# EAGLE design BLE Development Board v2.2 (EAGLE 6.4)
Bluetooth Low Energy Development Board Full breakout board for HM-10 module based on CC2540 chip with optional LEDs, programming header, USB access, etc.
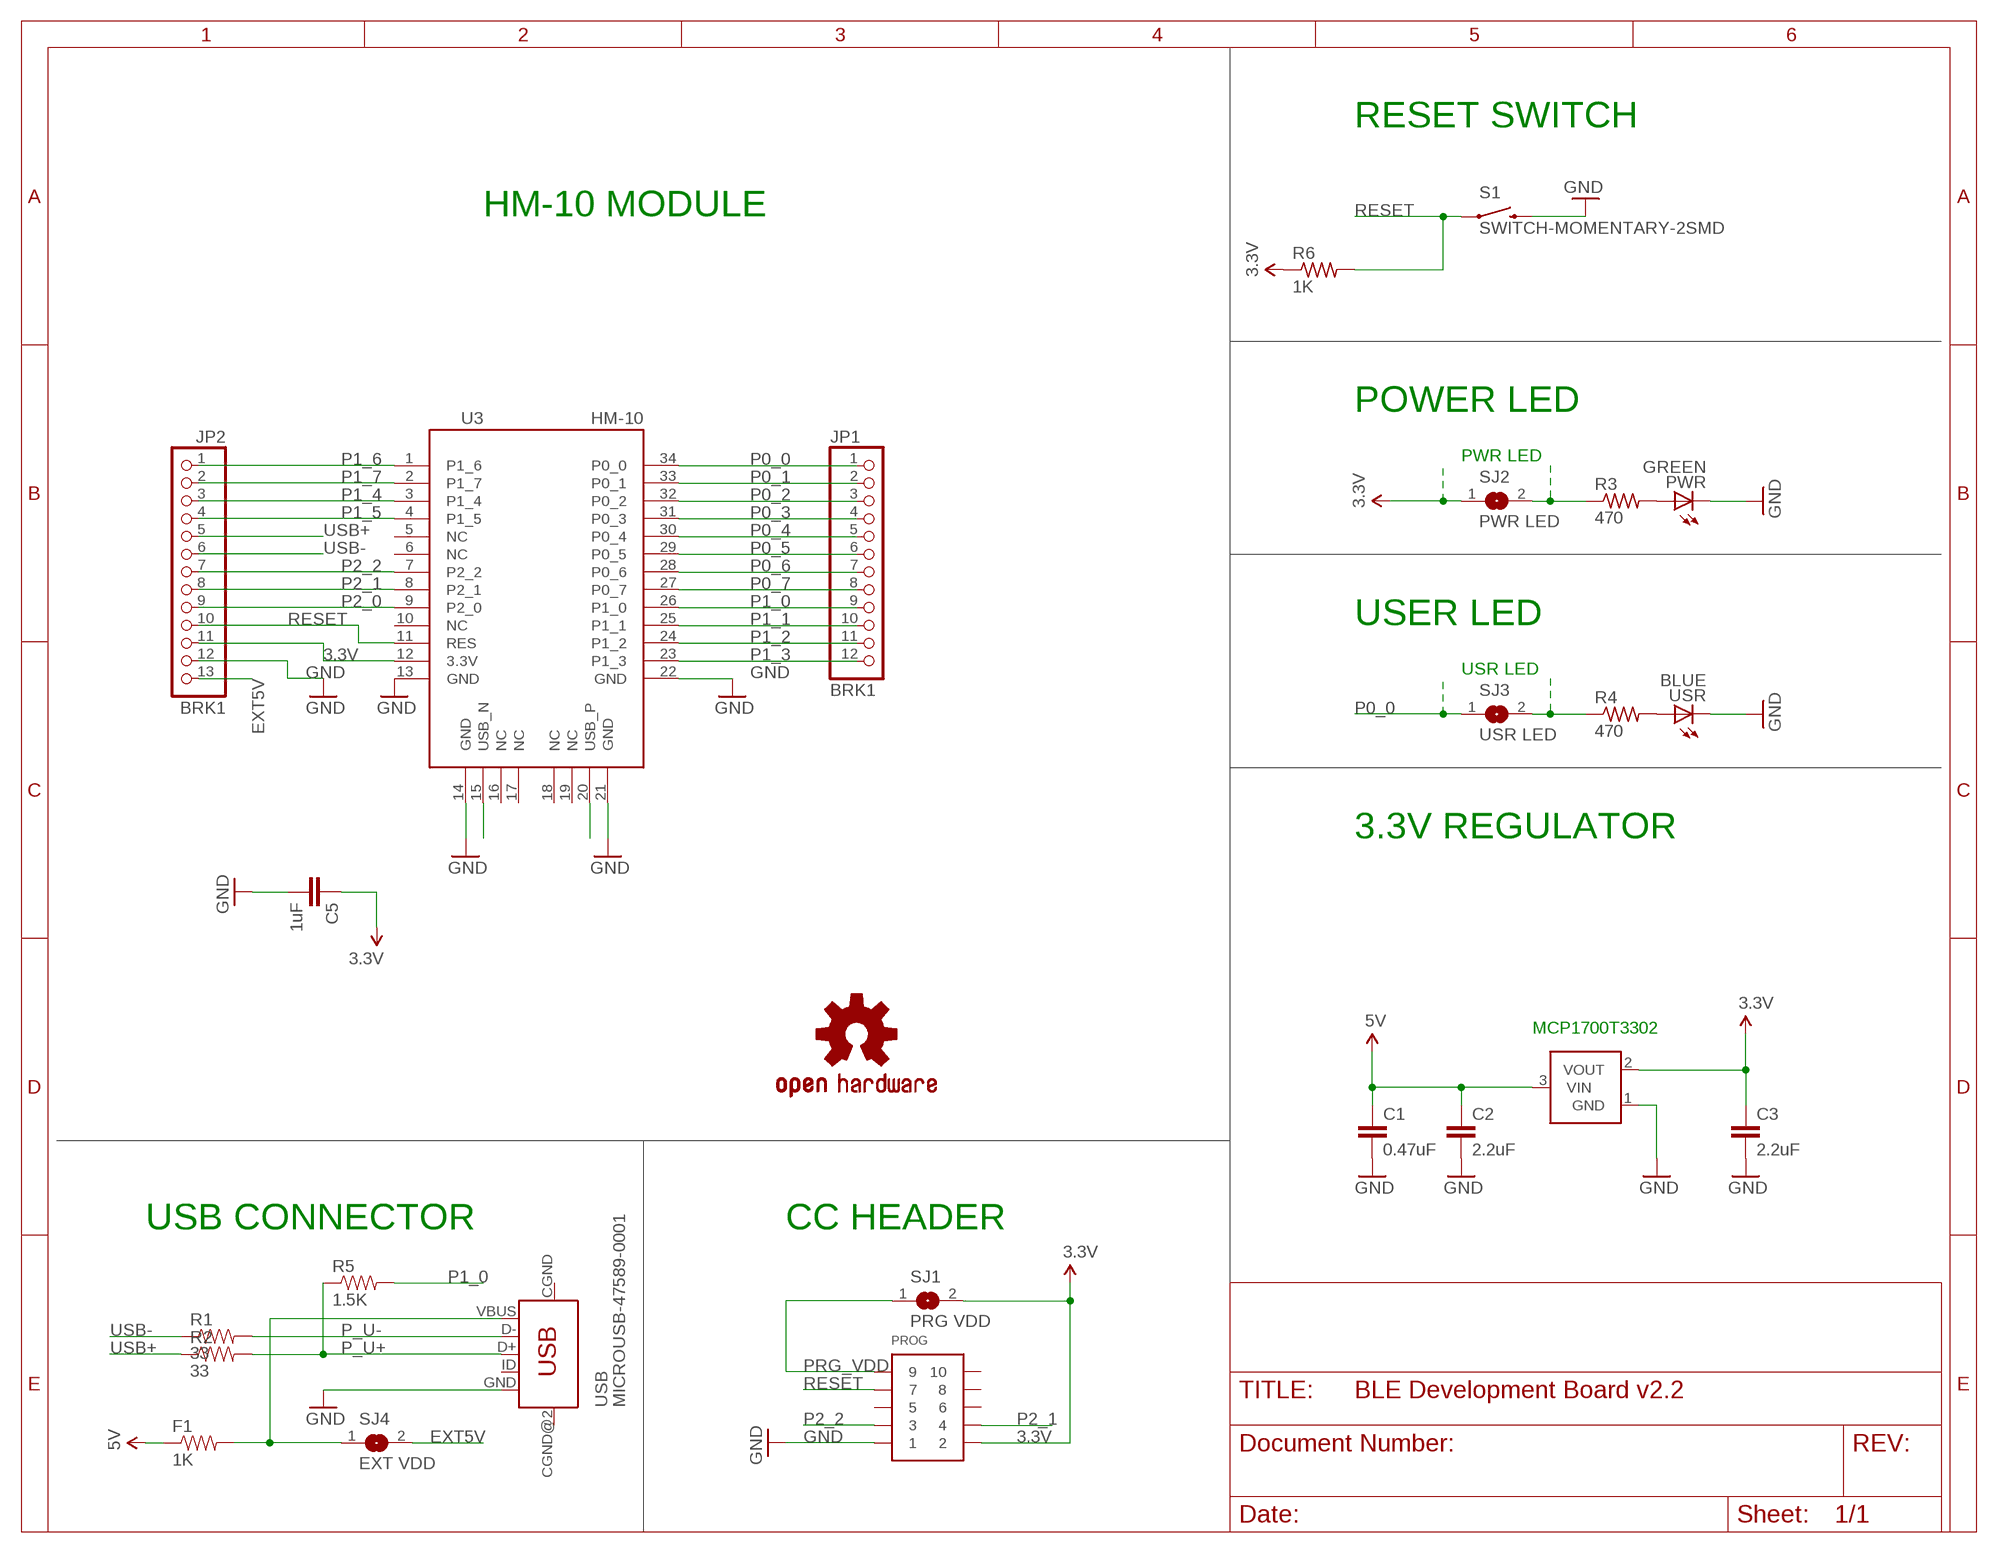
[diagram p0: schematic, sheet 1]

## Parts
C1  0.47uF  CAP0603-CAP  [0603-CAP]
C2  2.2uF  CAP0603-CAP  [0603-CAP]
C3  2.2uF  CAP0603-CAP  [0603-CAP]
C5  1uF  CAP0603-CAP  [0603-CAP]
F1  1K  RESISTOR0805-RES  [0805]
JP1  BRK1  PINHD-1X12  [1X12]
JP2  BRK1  PINHD-1X13  [1X13]
OSHW1  OSHW-LOGOL  [OSHW-LOGO-L]
PROG  CONN_5-2-FTSH-V  [FTSH-105-DV]
PWR  GREEN  LEDCHIPLED_0603  [CHIPLED_0603]
R1  33  RESISTOR0603-RES  [0603-RES]
R2  33  RESISTOR0603-RES  [0603-RES]
R3  470  R-US_R0603  [R0603]
R4  470  R-US_R0603  [R0603]
R5  1.5K  RESISTOR0603-RES  [0603-RES]
R6  1K  R-US_R0603  [R0603]
S1  SWITCH-MOMENTARY-2SMD  [TACTILE_SWITCH_SMD]
SJ1  PRG VDD  SJ  [SJ]
SJ2  PWR LED  SJ  [SJ]
SJ3  USR LED  SJ  [SJ]
SJ4  EXT VDD  SJ  [SJ]
U2  MCP1700  [SOT23-3]
U3  HM-10  [HM-10]
USB  MICROUSB-47589-0001  [MICROUSB-47589-0001]
USR  BLUE  LEDCHIPLED_0603  [CHIPLED_0603]

## Nets
3.3V [power]: C3.1 C5.1 JP2.11 PROG.2 R6.1 SJ1.2 SJ2.1 U2.2(VOUT) U3.12(3.3V)
5V [power]: C1.1 C2.1 F1.1 U2.3(VIN)
EXT5V [power]: JP2.13 SJ4.2
GND [power]: C1.2 C2.2 C3.2 C5.2 JP2.12 PROG.1 PWR.C S1.3 U2.1(GND) U3.13(GND) U3.14(GND) U3.21(GND) U3.22(GND) USB.GND USR.C
N$1: PWR.A R3.2
N$3 [power]: R3.1 SJ2.2
N$4: R4.2 USR.A
N$5: R4.1 SJ3.2
P0_0: JP1.1 SJ3.1 U3.34(P0_0)
P0_1: JP1.2 U3.33(P0_1)
P0_2: JP1.3 U3.32(P0_2)
P0_3: JP1.4 U3.31(P0_3)
P0_4: JP1.5 U3.30(P0_4)
P0_5: JP1.6 U3.29(P0_5)
P0_6: JP1.7 U3.28(P0_6)
P0_7: JP1.8 U3.27(P0_7)
P1_0: JP1.9 R5.2 U3.26(P1_0)
P1_1: JP1.10 U3.25(P1_1)
P1_2: JP1.11 U3.24(P1_2)
P1_3: JP1.12 U3.23(P1_3)
P1_4: JP2.3 U3.3(P1_4)
P1_5: JP2.4 U3.4(P1_5)
P1_6: JP2.1 U3.1(P1_6)
P1_7: JP2.2 U3.2(P1_7)
P2_0: JP2.9 U3.9(P2_0)
P2_1: JP2.8 PROG.4 U3.8(P2_1)
P2_2: JP2.7 PROG.3 U3.7(P2_2)
P_U+: R2.2 R5.1 USB.D+
P_U-: R1.2 USB.D-
PRG_VDD [power]: PROG.9 SJ1.1
RESET: JP2.10 PROG.7 R6.2 S1.1 U3.11(RES)
USB+: JP2.5 R2.1 U3.20(USB_P)
USB-: JP2.6 R1.1 U3.15(USB_N)
VBUS [power]: F1.2 SJ4.1 USB.VBUS
Unconnected: PROG.5 PROG.6 PROG.8 PROG.10 U3.5(NC) U3.6(NC) U3.10(NC) U3.16(NC) U3.17(NC) U3.18(NC) U3.19(NC) USB.CGND(MTN2) USB.CGND@2(MTN4) USB.ID

## Notes on the sheet
- RESET SWITCH
- HM-10 MODULE
- POWER LED
- PWR LED
- USER LED
- USR LED
- 3.3V REGULATOR
- MCP1700T3302
- USB CONNECTOR | CC HEADER

## Library data of the parts
C1-C3 C5 = SparkFun:CAP: Capacitor Standard 0603 ceramic capacitor, and 0.1" leaded capacitor.
F1 R1 R2 R5 = SparkFun:RESISTOR: Resistor Basic schematic elements and footprints for 0603, 1206, and PTH resistors.
JP1 = sf-pinhead:PINHD-1X12: PIN HEADER
JP2 = sf-pinhead:PINHD-1X13: PIN HEADER
OSHW1 = SparkFun:OSHW-LOGO: Open Source Hardware Logo This logo indicates the piece of hardware it is found on incorporates a OSHW license and/or adheres to the definition of open source hardware found here: http://freedomdefined.org/OSHW
PROG = pel_misc:CONN_5-2
PWR USR = led:LED: LED OSRAM: - CHIPLED LG R971, LG N971, LY N971, LG Q971, LY Q971, LO R971, LY R971 LH N974, LH R974 LS Q976, LO Q976, LY Q976 LO Q996 - Hyper CHIPLED LW Q18S LB Q993, LB Q99A, LB R99A - SideLED LS A670, LO A670, LY A670, LG A670, LP A670 LB A673, LV A673, LT A673, LW A673 LH A674 LY A675 LS A676, LA A676, LO A676, LY A676, LW A676 LS A679, LY A679, LG A679 - Hyper Micro SIDELED® LS Y876, LA Y876, LO Y876, LY Y876 LT Y87S - SmartLED LW L88C, LW L88S LB L89C, LB L89S, LG L890 LS L89K, LO L89K, LY L89K LS L896, LA L896, LO L896, LY L896 - TOPLED LS T670, LO T670, LY T670, LG T670, LP T670 LSG T670, LSP T670, LSY T670, LOP T670, LYG T670 LG T671, LOG T671, LSG T671 LB T673, LV T673, LT T673, LW T673 LH T674 LS T676, LA T676, LO T676, LY T676, LB T676, LH T676, LSB T676, LW T676 LB T67C, LV T67C, LT T67C, LS T67K, LO T67K, LY T67K, LW E67C LS E67B, LA E67B, LO E67B, LY E67B, LB E67C, LV E67C, LT E67C LW T67C LS T679, LY T679, LG T679 LS T770, LO T770, LY T770, LG T770, LP T770 LB T773, LV T773, LT T773, LW T773 LH T774 LS E675, LA E675, LY E675, LS T675 LS T776, LA T776, LO T776, LY T776, LB T776 LHGB T686 LT T68C, LB T68C - Hyper Mini TOPLED® LB M676 - Mini TOPLED Santana® LG M470 LS M47K, LO M47K, LY M47K Source: http://www.osram.convergy.de LUXEON: - LUMILED® LXK2-PW12-R00, LXK2-PW12-S00, LXK2-PW14-U00, LXK2-PW14-V00 LXK2-PM12-R00, LXK2-PM12-S00, LXK2-PM14-U00 LXK2-PE12-Q00, LXK2-PE12-R00, LXK2-PE12-S00, LXK2-PE14-T00, LXK2-PE14-U00 LXK2-PB12-K00, LXK2-PB12-L00, LXK2-PB12-M00, LXK2-PB14-N00, LXK2-PB14-P00, LXK2-PB14-Q00 LXK2-PR12-L00, LXK2-PR12-M00, LXK2-PR14-Q00, LXK2-PR14-R00 LXK2-PD12-Q00, LXK2-PD12-R00, LXK2-PD12-S00 LXK2-PH12-R00, LXK2-PH12-S00 LXK2-PL12-P00, LXK2-PL12-Q00, LXK2-PL12-R00 Source: www.luxeon.com KINGBRIGHT: KA-3528ASYC Source: www.kingbright.com
R3 R4 R6 = resistor:R-US_: RESISTOR, American symbol
S1 = SparkFun-Electromechanical:SWITCH-MOMENTARY-2: Various NO switches- pushbuttons, reed, etc
SJ1-SJ4 = jumper:SJ: SMD solder JUMPER
U2 = nonolith:MCP1700: Voltage regulator
U3 = HM-10_BLE:HM-10
USB = sf-keyglove:MICROUSB-47589-0001

## Net classes
0 default: width 0.152 mm, drill 0.33 mm, clearance 0.152 mm
1 power: width 0.254 mm, drill 0.33 mm, clearance 0.152 mm

## Board
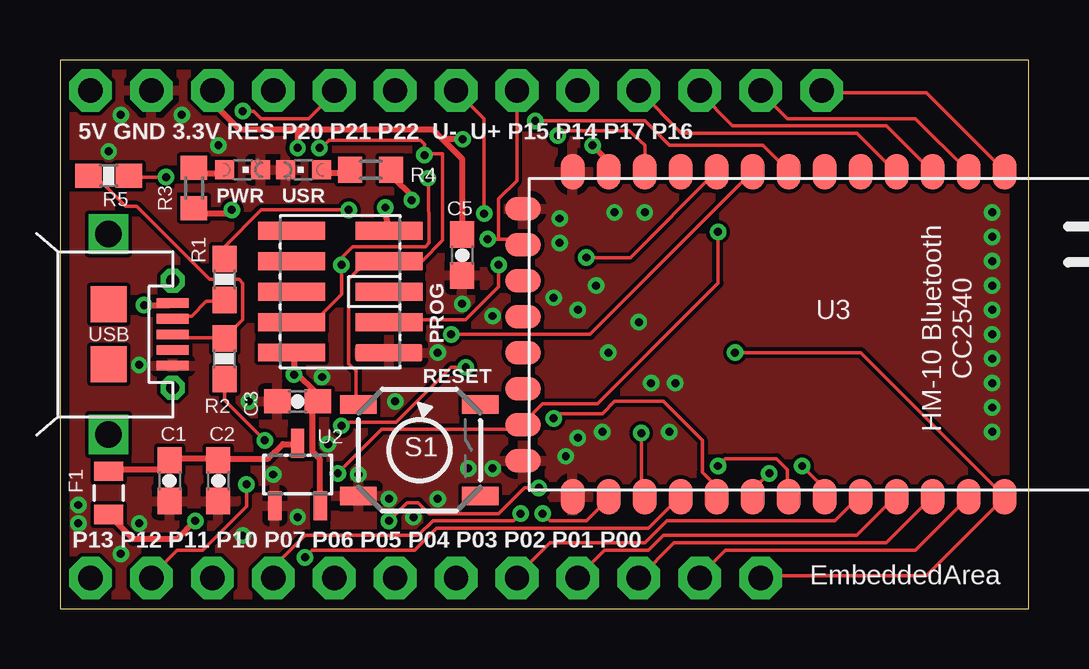
[diagram p1: board, top side]
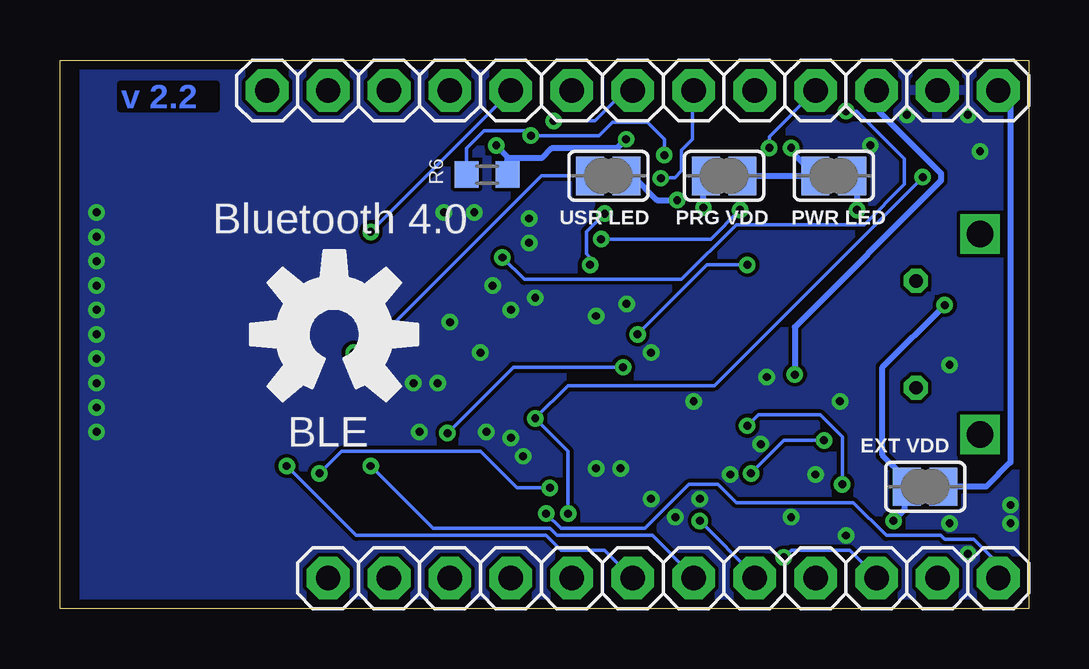
[diagram p2: board, bottom side, seen from below]

Size 40.39 x 22.86 mm. Coordinates in mm from the lower left corner, seen from the top.
Outline: 0,0 40.39,0 40.39,22.86 0,22.86 0,0
Copper layers (1*16): Top 0.0356mm / dielectric 1.5011mm / Bottom 0.0356mm
Design rules "LaenPCBOrder": minimum track width 6mil, minimum drill 13mil, track to track 6mil, track to pad 6mil, pad to pad 6mil, via to via 6mil, smd to smd 6mil, copper to edge 15mil, drill to drill 6mil, minimum pad ring 7mil, minimum via ring 7mil, stop-mask expansion 4mil, vias tented up to drill 13mil, thermal gap 10mil
vRestrict: area 0.5,19.6 to 33,20.3; area 0.3,2.5 to 30.2,3.3

### Footprints (pad centres in the part's own frame; a part is rotated, then mirrored left to right if it is on the bottom)
0603-CAP = smd 1.1 x 1: 1 -0.85,0; 2 0.85,0
0805 = smd 0.8 x 1.2: 1 -0.9,0; 2 0.9,0
1X12 = drill 1.016 pad 1.778 octagon: 1 -13.97,0; 2 -11.43,0; 3 -8.89,0; 4 -6.35,0; 5 -3.81,0; 6 -1.27,0; 7 1.27,0; 8 3.81,0; 9 6.35,0; 10 8.89,0; 11 11.43,0; 12 13.97,0
1X13 = drill 1.016 pad 1.778 octagon: 1 -15.24,0; 2 -12.7,0; 3 -10.16,0; 4 -7.62,0; 5 -5.08,0; 6 -2.54,0; 7 0,0; 8 2.54,0; 9 5.08,0; 10 7.62,0; 11 10.16,0; 12 12.7,0; 13 15.24,0
FTSH-105-DV = smd 0.74 x 2.8: 1 -2.54,-2.03; 2 -2.54,2.03; 3 -1.27,-2.03; 4 -1.27,2.03; 5 0,-2.03; 6 0,2.03; 7 1.27,-2.03; 8 1.27,2.03; 9 2.54,-2.03; 10 2.54,2.03
CHIPLED_0603 = smd 0.8 x 0.8: A 0,-0.75; C 0,0.75
0603-RES = smd 1.1 x 1: 1 -0.85,0; 2 0.85,0
R0603 = smd 1 x 1.1: 1 -0.85,0; 2 0.85,0
TACTILE_SWITCH_SMD = smd 1.524 x 0.762: 1 -2.54,1.905; 2 2.54,1.905; 3 -2.54,-1.905; 4 2.54,-1.905
SJ = smd 1.168 x 1.6: 1 -0.762,0; 2 0.762,0
SOT23-3 = smd 0.55 x 1.2: 1 0.95,1.3; 2 -0.95,1.3; 3 0,-1.3
HM-10 = smd 1.5 x 1: 1 -6.77,6.35; 2 -6.77,4.85; 3 -6.77,3.35; 4 -6.77,1.85; 5 -6.77,0.35; 6 -6.77,-1.15; 7 -6.77,-2.65; 8 -6.77,-4.15; 9 -6.77,-5.65; 10 -6.77,-7.15; 11 -6.77,-8.65; 12 -6.77,-10.15; 13 -6.77,-11.65; 22 6.77,-11.65; 23 6.77,-10.15; 24 6.77,-8.65; 25 6.77,-7.15; 26 6.77,-5.65; 27 6.77,-4.15; 28 6.77,-2.65; 29 6.77,-1.15; 30 6.77,0.35; 31 6.77,1.85; 32 6.77,3.35; 33 6.77,4.85; 34 6.77,6.35 | smd 1 x 1.5: 14 -5.23,-13.72; 15 -3.73,-13.72; 16 -2.23,-13.72; 17 -0.73,-13.72; 18 0.77,-13.72; 19 2.27,-13.72; 20 3.77,-13.72; 21 5.27,-13.72
MICROUSB-47589-0001 = drill 0.55 pad 1 octagon: CGND 0,2.225; CGND@2 0,-2.225 | drill 1.1 pad 1.6 square: CGND@3 -2.675,-4.175; CGND@4 -2.675,4.175 | smd 1.5 x 1.5: CGND@5 -2.675,1.25; CGND@6 -2.675,-1.25 | smd 1.35 x 0.4: D+ 0,0; D- 0,0.65; GND 0,-1.3; ID 0,-0.65; VBUS 0,1.3

### Placement (x,y rotation side)
C1  4.57,5.33 270 top
C2  6.6,5.33 270 top
C3  9.91,8.64 180 top
C5  16.76,14.73 270 top
F1  2.03,4.83 270 top
JP1  15.24,1.27 0 bottom
JP2  16.51,21.59 0 bottom
OSHW1  28.96,11.43 0 bottom
PROG  11.68,13.21 90 top
PWR  7.62,18.29 270 top
R1  6.86,13.72 270 top
R2  6.86,10.41 90 top
R3  5.59,17.53 90 top
R4  12.95,18.29 180 top
R5  2.03,18.03 0 top
R6  22.58,18.08 180 bottom
S1  14.99,6.6 0 top
SJ1  12.7,18.03 0 bottom
SJ2  8.13,18.03 0 bottom
SJ3  17.53,18.03 0 bottom
SJ4  4.32,5.08 0 bottom
U2  9.91,5.59 180 top
U3  33.02,11.43 270 top
USB  4.7,11.43 0 top
USR  10.16,18.29 90 top

### Tracks (layer width: path | path; a pad name or v marks a point on that pad's centre or on a via)
3.3V  (via drill 0.33)
  Top 0.254: 9.83,9.83 9.75,9.91 9.75,10.67 PROG.2 | 9.83,9.83 10.67,8.99 10.67,8.69 C3.1 10.52,8.99 10.52,6.55 10.82,6.25 10.82,4.42 U2.2 | C5.1 16.76,18.75 15.95,19.56 | 15.95,19.56 15.54,19.96 9.91,19.96 | 9.91,19.96 7.47,19.96 6.4,21.03 6.4,21.49 JP2.11 | 9.91,19.96 v9.91,19.2 | v9.75,9.75 9.83,9.83 | U3.12 22.87,18.61 v22.2,19.3 | v16.79,19.56 15.95,19.56
  Bottom 0.254: v9.91,19.2 9.91,19.05 SJ2.1 SJ1.2 | v9.75,9.75 9.75,11.73 3.66,17.83 3.66,18.14 6.25,20.73 6.25,21.49 JP2.11 | v16.79,19.56 17.17,19.18 19.89,19.18 20.3,18.77 21.69,18.77 | 21.69,18.77 v22.2,19.3 | R6.1 21.73,18.73 21.69,18.77
5V
  Top 0.254: F1.1 2.13,5.79 4.27,5.79 4.57,6.1 C1.1 4.57,6.25 6.55,6.25 C2.1 6.71,6.25 8.69,6.25 9.3,6.86 9.91,6.86 U2.3
EXT5V
  Bottom 0.254: JP2.13 0.76,21.08 0.76,6.1 1.78,5.08 SJ4.2
GND  (via drill 0.33)
  other vias: 7.87,8.64 13.72,4.57 9.91,3.81 8.89,5.59 3.3,3.56 0.76,4.32 3.3,10.16 15.75,10.67 22.61,7.37 21.08,6.35 23.11,16.51 24.38,16.51 16.76,12.7 2.54,20.57 5.08,20.57 6.6,19.3 13.97,8.64 17.02,5.84 12.45,5.59 14.73,3.81 18.03,5.84 15.75,4.57 2.54,2.29 7.62,3.05 11.18,6.86 18.03,12.19 10.92,9.65 20.57,12.95 21.59,12.45 22.35,13.46 20.83,16.26 20.83,15.24 21.59,7.11 22.86,10.67 24.64,9.4 25.65,9.4 25.4,7.37 24.13,11.94 0.76,3.56 38.86,16.51 38.86,15.49 38.86,14.48 38.86,13.46 38.86,12.45 38.86,11.43 38.86,10.41 38.86,9.4 38.86,8.38 38.86,7.37 2.03,19.05
  pour Top: 0,22.86 39.37,22.86 39.37,0 0,0
  pour Bottom: 0,22.86 39.37,22.86 39.37,0 0,0
N$1
  Top 0.152: 6.86,18.14 PWR.A | 5.64,18.14 R3.2
  Top 0.254: 5.64,18.14 6.86,18.14
N$3  (via drill 0.33)
  Top 0.254: v7.16,16.61 7.01,16.46 5.64,16.46 R3.1
  Bottom 0.254: v7.16,16.61 7.16,17.53 7.47,17.83 7.47,17.98 SJ2.2
N$4
  Top 0.152: 10.97,18.14 USR.A | 12.04,18.14 R4.2
  Top 0.254: 12.04,18.14 10.97,18.14
N$5  (via drill 0.33)
  Top 0.152: 13.87,17.98 R4.1
  Top 0.254: 13.87,17.98 14.66,17.2 v14.66,17.02
  Bottom 0.254: SJ3.2 16.51,18.03 15.49,17.02 v14.66,17.02
N$6
  Bottom 0.152: 7.62,18.03 8.64,18.03
N$8
  Bottom 0.152: 17.02,18.03 18.03,18.03
N$9
  Bottom 0.152: 12.19,18.03 13.21,18.03
N$10
  Bottom 0.152: 3.81,5.08 4.83,5.08
P0_0  (via drill 0.33)
  Top 0.152: JP1.1 29.26,1.37 36.12,1.37 39.32,4.57 U3.34 39.32,4.72 33.38,10.67 v28.14,10.67
  Bottom 0.152: SJ3.1 18.29,17.98 18.34,18.03 20.32,18.03 27.69,10.67 v28.14,10.67
P0_1
  Top 0.152: U3.33 37.8,4.57 35.66,2.44 27.74,2.44 26.67,1.37 JP1.2
P0_2
  Top 0.152: JP1.3 25.6,2.74 34.44,2.74 36.27,4.57 U3.32
P0_3
  Top 0.152: U3.31 34.75,4.57 33.22,3.05 25.15,3.05 24.54,2.44 22.71,2.44 21.64,1.37 JP1.4
P0_4
  Top 0.152: U3.30 33.22,4.57 32.31,3.66 25.3,3.66 24.38,2.74 20.42,2.74 19.05,1.37 JP1.5
P0_5  (via drill 0.33)
  Top 0.152: v30.94,5.94 31.85,5.03 31.85,4.72 U3.29
  Bottom 0.152: v30.94,5.94 28.04,3.05 20.12,3.05 19.51,2.44 17.68,2.44 JP1.6
P0_6  (via drill 0.33)
  Top 0.152: v27.43,5.94 27.74,6.25 29.87,6.25 30.33,5.79 30.33,4.72 U3.28
  Bottom 0.152: v27.43,5.94 24.84,3.35 19.96,3.35 19.66,3.05 15.7,3.05 14.02,1.37 JP1.7
P0_7  (via drill 0.33)
  Top 0.152: v29.57,5.64 28.96,5.03 28.96,4.72 U3.27 | v19.96,5.03 19.36,5.03 18.29,3.96 15.39,3.96 14.94,4.42 14.48,4.42 v13.72,3.66
  Bottom 0.152: v29.57,5.64 28.65,6.55 22.86,6.55 21.34,5.03 v19.96,5.03 | v13.72,3.66 11.43,1.37 JP1.8
P1_0  (via drill 0.33)
  Top 0.152: v4.42,17.98 2.9,17.98 R5.2 | U3.26 27.28,4.72 27.28,5.18 26.77,5.69 26.77,7.01 25.15,8.64 23.11,8.64 22.61,8.13 20.78,8.13 v20.57,7.92 | v19.2,3.96 18.9,3.66 15.54,3.66 14.94,3.05 10.21,3.05 8.99,1.83 8.99,1.37 JP1.9
  Bottom 0.152: v4.42,17.98 13.11,9.3 19.2,9.3 v20.57,7.92 19.2,6.55 v19.2,3.96
P1_1  (via drill 0.33)
  Top 0.152: v10.21,2.13 10.52,2.44 14.78,2.44 15.7,3.35 24.54,3.35 25.76,4.57 U3.25
  Bottom 0.152: v10.21,2.13 9.91,2.44 7.47,2.44 6.4,1.37 JP1.10
P1_2  (via drill 0.33)
  Top 0.152: v24.23,7.32 24.23,4.72 U3.24 | v11.73,7.62 11.89,7.77 14.02,7.77 16.31,10.06 v16.92,10.06 | v7.77,5.18 7.77,4.27 5.94,2.44 4.88,2.44 3.81,1.37 JP1.11
  Bottom 0.152: v11.73,7.62 11.28,8.08 8.69,8.08 7.77,7.16 v7.77,5.18 | v16.92,10.06 21.49,10.06 v24.23,7.32
P1_3  (via drill 0.33)
  Top 0.152: v20.12,3.96 20.42,3.66 21.95,3.66 22.86,4.57 U3.23
  Bottom 0.152: v20.12,3.96 19.51,3.35 16,3.35 14.17,5.18 12.95,5.18 12.19,4.42 7.32,4.42 5.94,3.05 3.66,3.05 3.5,2.9 2.29,2.9 1.37,1.98 1.37,1.37 JP1.12
P1_4
  Top 0.152: U3.3 36.27,18.29 34.44,20.12 28.04,20.12 26.67,21.49 JP2.3
P1_5
  Top 0.152: JP2.4 25.91,19.81 33.22,19.81 34.75,18.29 U3.4
P1_6
  Top 0.152: U3.1 39.32,18.29 36.12,21.49 31.85,21.49 JP2.1
P1_7
  Top 0.152: U3.2 37.8,18.29 35.66,20.42 30.33,20.42 29.26,21.49 JP2.2
P2_0  (via drill 0.33)
  Top 0.152: v21.95,14.63 23.77,14.63 27.28,18.14 U3.9 | v7.62,20.73 8.08,20.73 8.38,20.42 10.36,20.42 11.43,21.49 JP2.9
  Bottom 0.152: v21.95,14.63 21.03,13.72 14.48,13.72 12.19,16 6.86,16 5.18,17.68 5.18,18.75 7.16,20.73 v7.62,20.73
P2_1  (via drill 0.33)
  Top 0.152: U3.8 28.8,18.14 22.1,11.43 v16.31,11.43 | PROG.4 9.75,12.04 10.67,12.04 11.73,13.11 v11.73,14.33 11.73,14.63 12.19,15.09 15.24,15.09 15.39,15.24 15.37,17.78 v15.34,17.93
  Bottom 0.152: v16.31,11.43 13.41,14.33 v11.73,14.33 | JP2.8 14.02,21.49 14.02,19.56 14.48,19.1 14.48,18.24 14.76,17.96 15.32,17.96 v15.34,17.93
P2_2  (via drill 0.33)
  Top 0.152: U3.7 30.33,18.29 29.31,19.3 25.4,19.3 24.38,20.32 v19.81,20.32 | v18.29,14.33 18.29,13.41 16.92,12.04 13.72,12.04 PROG.3 | v17.68,16.46 17.68,20.42 JP2.7
  Bottom 0.152: v18.29,14.33 18.29,14.63 18.44,14.78 18.44,15.7 v17.68,16.46 | JP2.7 16.82,21.59 18.09,20.32 v19.81,20.32
P_U+
  Top 0.152: 6.86,11.28 4.88,11.28 4.72,11.43 USB.D+ | 6.86,11.28 7.62,12.04 7.62,13.56 7.47,13.72 6.25,13.72 3.2,16.76 2.74,16.76 1.52,17.98 1.22,17.98 R5.1 | 6.86,11.28 R2.2
P_U-
  Top 0.152: R1.2 6.86,12.8 6.1,12.8 5.49,12.19 4.72,12.19 USB.D-
PRG_VDD  (via drill 0.33)
  Top 0.254: v13.56,16.71 13.56,16.46 13.72,15.85 PROG.9
  Bottom 0.254: v13.56,16.71 13.56,17.98 SJ1.1
RESET  (via drill 0.33)
  Top 0.152: S1.1 12.34,8.53 12.34,9.91 12.04,10.21 12.04,13.72 12.8,14.48 PROG.7 15.09,14.48 15.95,15.34 15.95,18.95 15.24,18.95 v15.19,18.9 15.19,19.36 15.04,19.51 11.23,19.51 10.92,19.2 v10.82,19.2 | U3.11 24.38,18.21 24.38,19.3 23.95,19.71 23.75,19.91 20.95,19.91 v20.75,19.71
  Bottom 0.152: JP2.10 10.82,19.66 v10.82,19.2 | v15.19,18.9 15.19,19.56 15.9,20.27 17.35,20.27 17.91,19.71 v20.75,19.71 20.95,19.91 22.71,19.91 23.43,19.19 R6.2
USB+  (via drill 0.33)
  Top 0.152: R2.1 6.86,8.69 v8.53,7.01 | v11.58,5.64 13.41,7.47 19.05,7.47 19.2,7.62 U3.20 19.36,7.77 20.12,8.53 22.4,8.53 27.43,13.56 v27.43,15.7
  Bottom 0.152: v8.53,7.01 10.21,7.01 v11.58,5.64 | v27.43,15.7 21.64,21.49 JP2.5
USB-  (via drill 0.33)
  Top 0.152: R1.1 6.86,15.09 8.38,16.61 v12.04,16.61 | 18.29,15.39 19.05,15.39 19.2,15.24 U3.15 | 18.29,15.39 v17.83,15.39 | JP2.6 19.05,17.83 18.29,17.07 18.29,15.39
  Bottom 0.152: v12.04,16.61 13.26,15.39 v17.83,15.39
VBUS  (via drill 0.33)
  Top 0.254: v5.64,3.66 4.88,2.9 3.05,2.9 2.13,3.81 F1.2 | v3.5,12.65 4.57,12.65 USB.VBUS
  Bottom 0.254: v5.64,3.66 5.18,4.12 5.18,5.03 SJ4.1 5.18,5.18 5.18,5.49 6.1,6.4 6.1,10.06 v3.5,12.65

### Text on the board
Bottom: v 2.2
tPlace: 5V GND 3.3V RES P20 P21 P22 U- U+ P15 P14 P17 P16 | HM-10 Bluetooth | CC2540 | RESET | P13 P12 P11 P10 P07 P06 P05 P04 P03 P02 P01 P00 | EmbeddedArea
bPlace: PWR LED | PRG VDD | USR LED | Bluetooth 4.0 | EXT VDD | BLE